# Altium schematic sheet SMF75A_C51164161_SMF75A_C5116416.schdoc.schdoc
size 127 x 99 mm
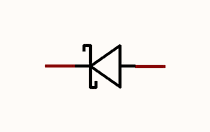
[diagram p0: SMF75A_C51164161_SMF75A_C5116416.schdoc.schdoc]

## Parts
D?  SMF75A_C5116416  [SOD-123FL_L2.8-W1.8-LS3.7-RD]  (value not drawn)

## Nets

Not connected (* = marked no-connect by the designer): D? 1(K) 2(A)

## Library data of the parts
D? = SMF75A_C5116416: Manufacturer: SHIKUES(时科); Manufacturer Part: SMF75A; Add into BOM: yes; polarity: 单向; Reverse Stand-Off Voltage (Vrwm): 75V; Maximum Clamping Voltage: 121V; Peak Pulse Current (Ipp)@10/1000us: 1.4A; Peak Pulse Power Dissipation (Ppp)@10/1000us: 200W; Breakdown Voltage: 92.1V; Reverse Leakage Current (Ir): 1uA; Symbol: SMF75A_C5116416; Device: SMF75A_C5116416; Supplier: LCSC; Supplier Part: C5116416; LCSC Part Name: 瞬态抑制二极管(TVS); Supplier Footprint: SOD-123FL; JLCPCB Part Class: Extended Part; Datasheet: https://atta.szlcsc.com/upload/public/pdf/source/20220715/82D6503F9C43F0DF9BB8970EC229759F.pdf; Convert to PCB: yes